# Altium schematic sheet LPDDR4_4X.schdoc: =
size A3; Symbol: Sheet-Symbol_A4; Company: 嘉立创EDA; Version: V1.0; Page Size: A4; @Project Name: RK3568_LPD4X_120P_Core; @Page Count: 17; @Update Date: 2025-08-20; @Create Date: 2025-08-15; @Schematic Name: Schematic1; @Page No: 16; @Page Name: LPDDR4/4X; Device: Sheet-Symbol_A4; Border: 1; Title Block Position: 3; Width: 1655; Height: 1170; Region Start: 1; X Region Count: 6; Y Region Count: 4; Blade Width: 10; @Board Name: Board1; @Create Time: 13:51:49; @Update Time: 20:30:34; Organization: ORGANIZATION; Address1: ADDRESS 1; Address2: ADDRESS 2; Address3: ADDRESS 3; Address4: ADDRESS 4; SheetNumber: 22; SheetTotal: 28
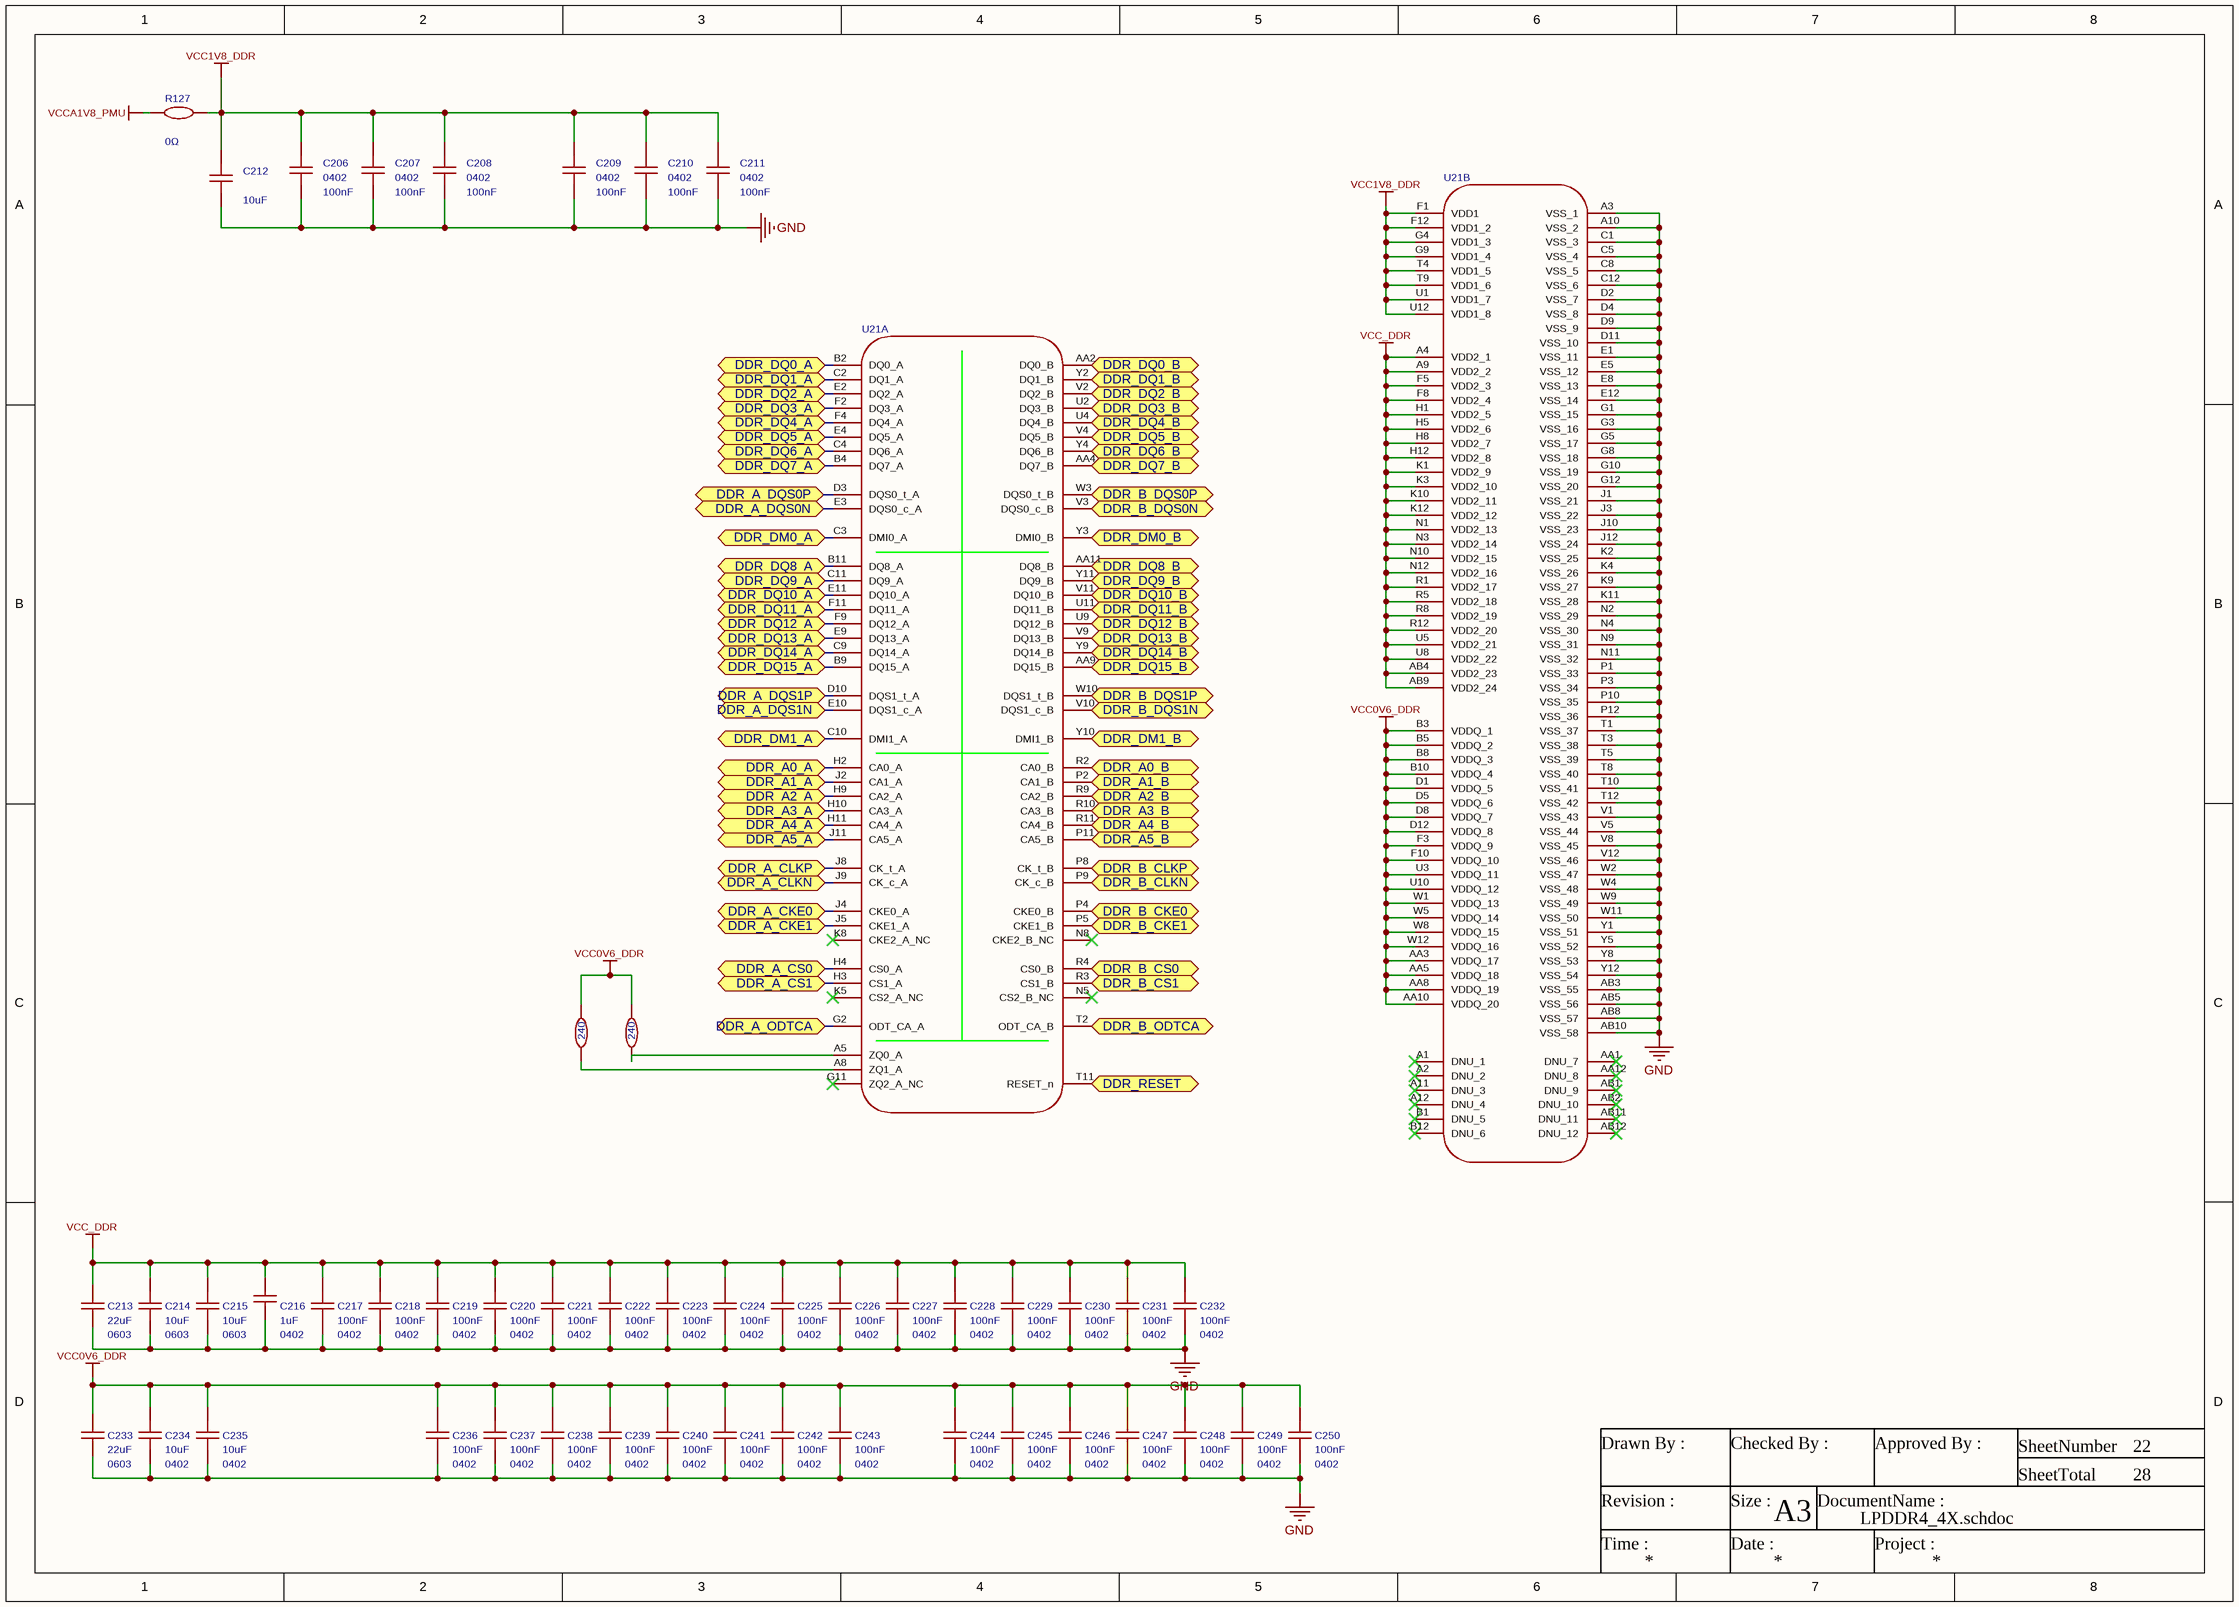
[diagram p0: LPDDR4_4X.schdoc]

## Parts
C206  100nF  Supplier Footprint: 0402  [MYC0402]
C207  100nF  Supplier Footprint: 0402  [MYC0402]
C208  100nF  Supplier Footprint: 0402  [MYC0402]
C209  100nF  Supplier Footprint: 0402  [MYC0402]
C210  100nF  Supplier Footprint: 0402  [MYC0402]
C211  100nF  Supplier Footprint: 0402  [MYC0402]
C212  10uF  [C0603]
C213  22uF  Supplier Footprint: 0603  [C0603]
C214  10uF  Supplier Footprint: 0603  [C0603]
C215  10uF  Supplier Footprint: 0603  [C0603]
C216  1uF  Supplier Footprint: 0402  [MYC0402]
C217  100nF  Supplier Footprint: 0402  [MYC0402]
C218  100nF  Supplier Footprint: 0402  [MYC0402]
C219  100nF  Supplier Footprint: 0402  [MYC0402]
C220  100nF  Supplier Footprint: 0402  [MYC0402]
C221  100nF  Supplier Footprint: 0402  [MYC0402]
C222  100nF  Supplier Footprint: 0402  [MYC0402]
C223  100nF  Supplier Footprint: 0402  [MYC0402]
C224  100nF  Supplier Footprint: 0402  [MYC0402]
C225  100nF  Supplier Footprint: 0402  [MYC0402]
C226  100nF  Supplier Footprint: 0402  [MYC0402]
C227  100nF  Supplier Footprint: 0402  [MYC0402]
C228  100nF  Supplier Footprint: 0402  [MYC0402]
C229  100nF  Supplier Footprint: 0402  [MYC0402]
C230  100nF  Supplier Footprint: 0402  [MYC0402]
C231  100nF  Supplier Footprint: 0402  [MYC0402]
C232  100nF  Supplier Footprint: 0402  [MYC0402]
C233  22uF  Supplier Footprint: 0603  [C0603]
C234  10uF  Supplier Footprint: 0402  [MYC0402]
C235  10uF  Supplier Footprint: 0402  [MYC0402]
C236  100nF  Supplier Footprint: 0402  [MYC0402]
C237  100nF  Supplier Footprint: 0402  [MYC0402]
C238  100nF  Supplier Footprint: 0402  [MYC0402]
C239  100nF  Supplier Footprint: 0402  [MYC0402]
C240  100nF  Supplier Footprint: 0402  [MYC0402]
C241  100nF  Supplier Footprint: 0402  [MYC0402]
C242  100nF  Supplier Footprint: 0402  [MYC0402]
C243  100nF  Supplier Footprint: 0402  [MYC0402]
C244  100nF  Supplier Footprint: 0402  [MYC0402]
C245  100nF  Supplier Footprint: 0402  [MYC0402]
C246  100nF  Supplier Footprint: 0402  [MYC0402]
C247  100nF  Supplier Footprint: 0402  [MYC0402]
C248  100nF  Supplier Footprint: 0402  [MYC0402]
C249  100nF  Supplier Footprint: 0402  [MYC0402]
C250  100nF  Supplier Footprint: 0402  [MYC0402]
R127  0Ω  [R0603]
R128  value 240  [r0402-nsk]  (hidden comment: Res_0402)
R129  value 240  [r0402-nsk]  (hidden comment: Res_0402)
U21  LPDDR4  [LPDDR4_MrX]  (value not drawn)  (parts A,B of 2)

## Ports
DDR_A0_A (bidir), DDR_A0_B (bidir), DDR_A1_A (bidir), DDR_A1_B (bidir), DDR_A2_A (bidir), DDR_A2_B (bidir), DDR_A3_A (bidir), DDR_A3_B (bidir), DDR_A4_A (bidir), DDR_A4_B (bidir), DDR_A5_A (bidir), DDR_A5_B (bidir), DDR_A_CKE0 (bidir), DDR_A_CKE1 (bidir), DDR_A_CLKN (bidir), DDR_A_CLKP (bidir), DDR_A_CS0 (bidir), DDR_A_CS1 (bidir), DDR_A_DQS0N (bidir), DDR_A_DQS0P (bidir), DDR_A_DQS1N (bidir), DDR_A_DQS1P (bidir), DDR_A_ODTCA (bidir), DDR_B_CKE0 (bidir), DDR_B_CKE1 (bidir), DDR_B_CLKN (bidir), DDR_B_CLKP (bidir), DDR_B_CS0 (bidir), DDR_B_CS1 (bidir), DDR_B_DQS0N (bidir), DDR_B_DQS0P (bidir), DDR_B_DQS1N (bidir), DDR_B_DQS1P (bidir), DDR_B_ODTCA (bidir), DDR_DM0_A (bidir), DDR_DM0_B (bidir), DDR_DM1_A (bidir), DDR_DM1_B (bidir), DDR_DQ0_A (bidir), DDR_DQ0_B (bidir), DDR_DQ1_A (bidir), DDR_DQ1_B (bidir), DDR_DQ2_A (bidir), DDR_DQ2_B (bidir), DDR_DQ3_A (bidir), DDR_DQ3_B (bidir), DDR_DQ4_A (bidir), DDR_DQ4_B (bidir), DDR_DQ5_A (bidir), DDR_DQ5_B (bidir), DDR_DQ6_A (bidir), DDR_DQ6_B (bidir), DDR_DQ7_A (bidir), DDR_DQ7_B (bidir), DDR_DQ8_A (bidir), DDR_DQ8_B (bidir), DDR_DQ9_A (bidir), DDR_DQ9_B (bidir), DDR_DQ10_A (bidir), DDR_DQ10_B (bidir), DDR_DQ11_A (bidir), DDR_DQ11_B (bidir), DDR_DQ12_A (bidir), DDR_DQ12_B (bidir), DDR_DQ13_A (bidir), DDR_DQ13_B (bidir), DDR_DQ14_A (bidir), DDR_DQ14_B (bidir), DDR_DQ15_A (bidir), DDR_DQ15_B (bidir), DDR_RESET (bidir)

## Nets
GND: C206.1 C207.1 C208.1 C209.1 C210.1 C211.1 C212.1 C213.1 C214.1 C215.1 C216.1 C217.2 C218.2 C219.2 C220.2 C221.2 C222.2 C223.2 C224.2 C225.2 C226.2 C227.2 C228.2 C229.2 C230.2 C231.2 C232.2 C233.1 C234.1 C235.1 C236.2 C237.2 C238.2 C239.2 C240.2 C241.2 C242.2 C243.2 C244.2 C245.2 C246.2 C247.2 C248.2 C249.2 C250.2 U21.A3(VSS_1) U21.A10(VSS_2) U21.AB3(VSS_55) U21.AB5(VSS_56) U21.AB8(VSS_57) U21.AB10(VSS_58) U21.C1(VSS_3) U21.C5(VSS_4) U21.C8(VSS_5) U21.C12(VSS_6) U21.D2(VSS_7) U21.D4(VSS_8) U21.D9(VSS_9) U21.D11(VSS_10) U21.E1(VSS_11) U21.E5(VSS_12) U21.E8(VSS_13) U21.E12(VSS_14) U21.G1(VSS_15) U21.G3(VSS_16) U21.G5(VSS_17) U21.G8(VSS_18) U21.G10(VSS_19) U21.G12(VSS_20) U21.J1(VSS_21) U21.J3(VSS_22) U21.J10(VSS_23) U21.J12(VSS_24) U21.K2(VSS_25) U21.K4(VSS_26) U21.K9(VSS_27) U21.K11(VSS_28) U21.N2(VSS_29) U21.N4(VSS_30) U21.N9(VSS_31) U21.N11(VSS_32) U21.P1(VSS_33) U21.P3(VSS_34) U21.P10(VSS_35) U21.P12(VSS_36) U21.T1(VSS_37) U21.T3(VSS_38) U21.T5(VSS_39) U21.T8(VSS_40) U21.T10(VSS_41) U21.T12(VSS_42) U21.V1(VSS_43) U21.V5(VSS_44) U21.V8(VSS_45) U21.V12(VSS_46) U21.W2(VSS_47) U21.W4(VSS_48) U21.W9(VSS_49) U21.W11(VSS_50) U21.Y1(VSS_51) U21.Y5(VSS_52) U21.Y8(VSS_53) U21.Y12(VSS_54)
VCC0V6_DDR: C233.2 C234.2 C235.2 C236.1 C237.1 C238.1 C239.1 C240.1 C241.1 C242.1 C243.1 C244.1 C245.1 C246.1 C247.1 C248.1 C249.1 C250.1 R128.2 R129.2 U21.AA3(VDDQ_17) U21.AA5(VDDQ_18) U21.AA8(VDDQ_19) U21.AA10(VDDQ_20) U21.B3(VDDQ_1) U21.B5(VDDQ_2) U21.B8(VDDQ_3) U21.B10(VDDQ_4) U21.D1(VDDQ_5) U21.D5(VDDQ_6) U21.D8(VDDQ_7) U21.D12(VDDQ_8) U21.F3(VDDQ_9) U21.F10(VDDQ_10) U21.U3(VDDQ_11) U21.U10(VDDQ_12) U21.W1(VDDQ_13) U21.W5(VDDQ_14) U21.W8(VDDQ_15) U21.W12(VDDQ_16)
VCC1V8_DDR: C206.2 C207.2 C208.2 C209.2 C210.2 C211.2 C212.2 R127.1 U21.F1(VDD1) U21.F12(VDD1_2) U21.G4(VDD1_3) U21.G9(VDD1_4) U21.T4(VDD1_5) U21.T9(VDD1_6) U21.U1(VDD1_7) U21.U12(VDD1_8)
VCC_DDR: C213.2 C214.2 C215.2 C216.2 C217.1 C218.1 C219.1 C220.1 C221.1 C222.1 C223.1 C224.1 C225.1 C226.1 C227.1 C228.1 C229.1 C230.1 C231.1 C232.1 U21.A4(VDD2_1) U21.A9(VDD2_2) U21.AB4(VDD2_23) U21.AB9(VDD2_24) U21.F5(VDD2_3) U21.F8(VDD2_4) U21.H1(VDD2_5) U21.H5(VDD2_6) U21.H8(VDD2_7) U21.H12(VDD2_8) U21.K1(VDD2_9) U21.K3(VDD2_10) U21.K10(VDD2_11) U21.K12(VDD2_12) U21.N1(VDD2_13) U21.N3(VDD2_14) U21.N10(VDD2_15) U21.N12(VDD2_16) U21.R1(VDD2_17) U21.R5(VDD2_18) U21.R8(VDD2_19) U21.R12(VDD2_20) U21.U5(VDD2_21) U21.U8(VDD2_22)
VCCA1V8_PMU: R127.2
DDR_A0_A: U21.H2(CA0_A) ; port DDR_A0_A
DDR_A0_B: U21.R2(CA0_B) ; port DDR_A0_B
DDR_A1_A: U21.J2(CA1_A) ; port DDR_A1_A
DDR_A1_B: U21.P2(CA1_B) ; port DDR_A1_B
DDR_A2_A: U21.H9(CA2_A) ; port DDR_A2_A
DDR_A2_B: U21.R9(CA2_B) ; port DDR_A2_B
DDR_A3_A: U21.H10(CA3_A) ; port DDR_A3_A
DDR_A3_B: U21.R10(CA3_B) ; port DDR_A3_B
DDR_A4_A: U21.H11(CA4_A) ; port DDR_A4_A
DDR_A4_B: U21.R11(CA4_B) ; port DDR_A4_B
DDR_A5_A: U21.J11(CA5_A) ; port DDR_A5_A
DDR_A5_B: U21.P11(CA5_B) ; port DDR_A5_B
DDR_A_CKE0: U21.J4(CKE0_A) ; port DDR_A_CKE0
DDR_A_CKE1: U21.J5(CKE1_A) ; port DDR_A_CKE1
DDR_A_CLKN: U21.J9(CK_c_A) ; port DDR_A_CLKN
DDR_A_CLKP: U21.J8(CK_t_A) ; port DDR_A_CLKP
DDR_A_CS0: U21.H4(CS0_A) ; port DDR_A_CS0
DDR_A_CS1: U21.H3(CS1_A) ; port DDR_A_CS1
DDR_A_DQS0N: U21.E3(DQS0_c_A) ; port DDR_A_DQS0N
DDR_A_DQS0P: U21.D3(DQS0_t_A) ; port DDR_A_DQS0P
DDR_A_DQS1N: U21.E10(DQS1_c_A) ; port DDR_A_DQS1N
DDR_A_DQS1P: U21.D10(DQS1_t_A) ; port DDR_A_DQS1P
DDR_A_ODTCA: U21.G2(ODT_CA_A) ; port DDR_A_ODTCA
DDR_B_CKE0: U21.P4(CKE0_B) ; port DDR_B_CKE0
DDR_B_CKE1: U21.P5(CKE1_B) ; port DDR_B_CKE1
DDR_B_CLKN: U21.P9(CK_c_B) ; port DDR_B_CLKN
DDR_B_CLKP: U21.P8(CK_t_B) ; port DDR_B_CLKP
DDR_B_CS0: U21.R4(CS0_B) ; port DDR_B_CS0
DDR_B_CS1: U21.R3(CS1_B) ; port DDR_B_CS1
DDR_B_DQS0N: U21.V3(DQS0_c_B) ; port DDR_B_DQS0N
DDR_B_DQS0P: U21.W3(DQS0_t_B) ; port DDR_B_DQS0P
DDR_B_DQS1N: U21.V10(DQS1_c_B) ; port DDR_B_DQS1N
DDR_B_DQS1P: U21.W10(DQS1_t_B) ; port DDR_B_DQS1P
DDR_B_ODTCA: U21.T2(ODT_CA_B) ; port DDR_B_ODTCA
DDR_DM0_A: U21.C3(DMI0_A) ; port DDR_DM0_A
DDR_DM0_B: U21.Y3(DMI0_B) ; port DDR_DM0_B
DDR_DM1_A: U21.C10(DMI1_A) ; port DDR_DM1_A
DDR_DM1_B: U21.Y10(DMI1_B) ; port DDR_DM1_B
DDR_DQ0_A: U21.B2(DQ0_A) ; port DDR_DQ0_A
DDR_DQ0_B: U21.AA2(DQ0_B) ; port DDR_DQ0_B
DDR_DQ1_A: U21.C2(DQ1_A) ; port DDR_DQ1_A
DDR_DQ1_B: U21.Y2(DQ1_B) ; port DDR_DQ1_B
DDR_DQ2_A: U21.E2(DQ2_A) ; port DDR_DQ2_A
DDR_DQ2_B: U21.V2(DQ2_B) ; port DDR_DQ2_B
DDR_DQ3_A: U21.F2(DQ3_A) ; port DDR_DQ3_A
DDR_DQ3_B: U21.U2(DQ3_B) ; port DDR_DQ3_B
DDR_DQ4_A: U21.F4(DQ4_A) ; port DDR_DQ4_A
DDR_DQ4_B: U21.U4(DQ4_B) ; port DDR_DQ4_B
DDR_DQ5_A: U21.E4(DQ5_A) ; port DDR_DQ5_A
DDR_DQ5_B: U21.V4(DQ5_B) ; port DDR_DQ5_B
DDR_DQ6_A: U21.C4(DQ6_A) ; port DDR_DQ6_A
DDR_DQ6_B: U21.Y4(DQ6_B) ; port DDR_DQ6_B
DDR_DQ7_A: U21.B4(DQ7_A) ; port DDR_DQ7_A
DDR_DQ7_B: U21.AA4(DQ7_B) ; port DDR_DQ7_B
DDR_DQ8_A: U21.B11(DQ8_A) ; port DDR_DQ8_A
DDR_DQ8_B: U21.AA11(DQ8_B) ; port DDR_DQ8_B
DDR_DQ9_A: U21.C11(DQ9_A) ; port DDR_DQ9_A
DDR_DQ9_B: U21.Y11(DQ9_B) ; port DDR_DQ9_B
DDR_DQ10_A: U21.E11(DQ10_A) ; port DDR_DQ10_A
DDR_DQ10_B: U21.V11(DQ10_B) ; port DDR_DQ10_B
DDR_DQ11_A: U21.F11(DQ11_A) ; port DDR_DQ11_A
DDR_DQ11_B: U21.U11(DQ11_B) ; port DDR_DQ11_B
DDR_DQ12_A: U21.F9(DQ12_A) ; port DDR_DQ12_A
DDR_DQ12_B: U21.U9(DQ12_B) ; port DDR_DQ12_B
DDR_DQ13_A: U21.E9(DQ13_A) ; port DDR_DQ13_A
DDR_DQ13_B: U21.V9(DQ13_B) ; port DDR_DQ13_B
DDR_DQ14_A: U21.C9(DQ14_A) ; port DDR_DQ14_A
DDR_DQ14_B: U21.Y9(DQ14_B) ; port DDR_DQ14_B
DDR_DQ15_A: U21.B9(DQ15_A) ; port DDR_DQ15_A
DDR_DQ15_B: U21.AA9(DQ15_B) ; port DDR_DQ15_B
DDR_RESET: U21.T11(RESET_n) ; port DDR_RESET
NetR128_1: R128.1 U21.A8(ZQ1_A)
NetR129_1: R129.1 U21.A5(ZQ0_A)

Not connected (* = marked no-connect by the designer): U21 A1(DNU_1)* A2(DNU_2)* A11(DNU_3)* A12(DNU_4)* AA1(DNU_7)* AA12(DNU_8)* AB1(DNU_9)* AB2(DNU_10)* AB11(DNU_11)* AB12(DNU_12)* B1(DNU_5)* B12(DNU_6)* G11(ZQ2_A_NC)* K5(CS2_A_NC)* K8(CKE2_A_NC)* N5(CS2_B_NC)* N8(CKE2_B_NC)*

## Notes on the sheet
- Drawn By :
- Checked By :
- Approved By :
- SheetNumber
- SheetTotal
- Revision :
- Time :
- Size :
- Date :
- A3
- DocumentName :
- Project :

## Library data of the parts
C206-C211 C217-C232 C236-C250 = CL05B104KB54PNC: 容值:100nF;精度:±10%;额定电压:50V;材质(温度系数):X7R;; Manufacturer: SAMSUNG(三星); Symbol: CL03A104KO3NNNC; AddInBom: yes; ModelId: 36a51122f27c49738f86b3bfa98863e0; ModelName: C0402_L1.0-W0.5-H0.5; ModelTransform: 39.37,19.685,0,0,0,0,0,0,0; Tolerance: ±10%; Voltage Rated: 50V; Temperature Coefficient: X7R; Device: CL05B104KB54PNC; LCSC Part Name: 100nF ±10% 50V; SupplierPart: C307331; ManufacturerPart: CL05B104KB54PNC; JLCPCB Part Class: Basic Part; Datasheet: https://atta.szlcsc.com/upload/public/pdf/source/20181009/C307331_222F7C870FD3EA5F46F538B483443886.pdf; Supplier: LCSC; ConvertToPcb: yes; FootprintName: MYC0402; Value: 100nF
C212 C214 C215 = CL10A106KP8NNNC: 容值:10uF;精度:±10%;额定电压:10V;材质(温度系数):X5R;; Manufacturer: SAMSUNG(三星); Symbol: 0603X106M100; AddInBom: yes; ModelId: ac125912035d415993ca9572d50418b1; ModelName: C0603_L1.6-W0.8-H0.8; ModelTransform: 62.992,31.496,0,0,0,0,0,0,0; Tolerance: ±10%; Voltage Rated: 10V; Temperature Coefficient: X5R; Device: CL10A106KP8NNNC; LCSC Part Name: 10uF ±10% 10V; SupplierPart: C19702; ManufacturerPart: CL10A106KP8NNNC; JLCPCB Part Class: Basic Part; Datasheet: https://atta.szlcsc.com/upload/public/pdf/source/20160103/1457707703378.pdf; Supplier: LCSC; ConvertToPcb: yes; FootprintName: C0603; Value: 10uF
  C212: Supplier Footprint: 0603
C213 C233 = CL10A226MQ8NRNC: 容值:22uF;精度:±20%;额定电压:6.3V;材质(温度系数):X5R;; Manufacturer: SAMSUNG(三星); Symbol: GRT188R61A226ME13D; AddInBom: yes; ModelId: ac125912035d415993ca9572d50418b1; ModelName: C0603_L1.6-W0.8-H0.8; ModelTransform: 62.992,31.496,0,0,0,0,0,0,0; Tolerance: ±20%; Voltage Rated: 6.3V; Temperature Coefficient: X5R; Device: CL10A226MQ8NRNC; LCSC Part Name: 22uF ±20% 6.3V; SupplierPart: C59461; ManufacturerPart: CL10A226MQ8NRNC; JLCPCB Part Class: Basic Part; Datasheet: https://atta.szlcsc.com/upload/public/pdf/source/20160218/1457707763339.pdf; Supplier: LCSC; ConvertToPcb: yes; FootprintName: C0603; Value: 22uF
C216 = CL05A105KP5NNNC: 容值:1uF;精度:±10%;额定电压:10V;材质(温度系数):X5R;; Manufacturer: SAMSUNG(三星); AddInBom: yes; ModelId: 36a51122f27c49738f86b3bfa98863e0; ModelName: C0402_L1.0-W0.5-H0.5; ModelTransform: 39.37,19.685,0,0,0,0,0,0,0; Tolerance: ±10%; Voltage Rated: 10V; Temperature Coefficient: X5R; Device: CL05A105KP5NNNC; Symbol: CL05A105KP5NNNC; LCSC Part Name: 1uF ±10% 10V; SupplierPart: C14445; ManufacturerPart: CL05A105KP5NNNC; JLCPCB Part Class: 扩展库; Datasheet: https://atta.szlcsc.com/upload/public/pdf/source/20160103/1457707670698.pdf; Supplier: LCSC; ConvertToPcb: yes; FootprintName: MYC0402; Value: 1uF
C234 C235 = CL05A106MQ5NUNC: 容值:10uF;精度:±20%;额定电压:6.3V;材质(温度系数):X5R;; Manufacturer: SAMSUNG(三星); Symbol: 0603X106M100; AddInBom: yes; ModelId: 36a51122f27c49738f86b3bfa98863e0; ModelName: C0402_L1.0-W0.5-H0.5; ModelTransform: 39.37,19.685,0,0,0,0,0,0,0; Tolerance: ±20%; Voltage Rated: 6.3V; Temperature Coefficient: X5R; JLCPCB Part Class: Basic Part; Device: CL05A106MQ5NUNC; LCSC Part Name: 10uF ±20% 6.3V; SupplierPart: C15525; ManufacturerPart: CL05A106MQ5NUNC; Datasheet: https://atta.szlcsc.com/upload/public/pdf/source/20220823/2B02EE04F8F211D38A52DCB16EB6BEBA.pdf; Supplier: LCSC; ConvertToPcb: yes; FootprintName: MYC0402; Value: 10uF
R127 = 0603WAF0000T5E: 电阻类型:厚膜电阻;阻值:0Ω;精度:±1%;功率:100mW;最大工作电压:75V;工作温度范围:-55℃~+155℃;; Manufacturer: UNI-ROYAL(厚声); AddInBom: yes; ModelId: 6bd5cd867e9542ebae21caaf5d2d4c4d; ModelTransform: 31.8897,63.7794,0,90,0,0,0,0,0; Tolerance: ±1%; Power(Watts): 100mW; Overload Voltage (Max): 75V; Device: 0603WAF0000T5E; Symbol: 0603WAF0000T5E; LCSC Part Name: 0Ω ±1% 100mW; SupplierPart: C21189; ManufacturerPart: 0603WAF0000T5E; Supplier Footprint: 0603; JLCPCB Part Class: Basic Part; Datasheet: https://atta.szlcsc.com/upload/public/pdf/source/20200306/C422600_1E6D84923E4A46A82E41ADD87F860B5C.pdf; Supplier: LCSC; ConvertToPcb: yes; FootprintName: R0603; ModelName: R0603; Type: 厚膜电阻; Value: 0Ω; Operating Temperature Range: -55℃~+155℃
R128 R129 = Res_0402: Symbol: 电阻; Check: false; ConvertToPcb: yes; ModelId: 671aefced39d4c318694bba8bd8efd39; ModelName: R0402_L1.0-W0.5-H0.5; ModelTransform: 39.37,19.685,0,0,0,0,0,0.0005,0; Device: Res_0402; AddInBom: yes; Supplier Footprint: 0402; FootprintName: r0402-nsk
U21 = LPDDR4: Check: false; AddInBom: yes; Device: LPDDR4; ConvertToPcb: yes; SymbolName: LPDDR4; FootprintName: LPDDR4_MrX